# EAGLE schematic keyesSensBrd (EAGLE 6.5.0)
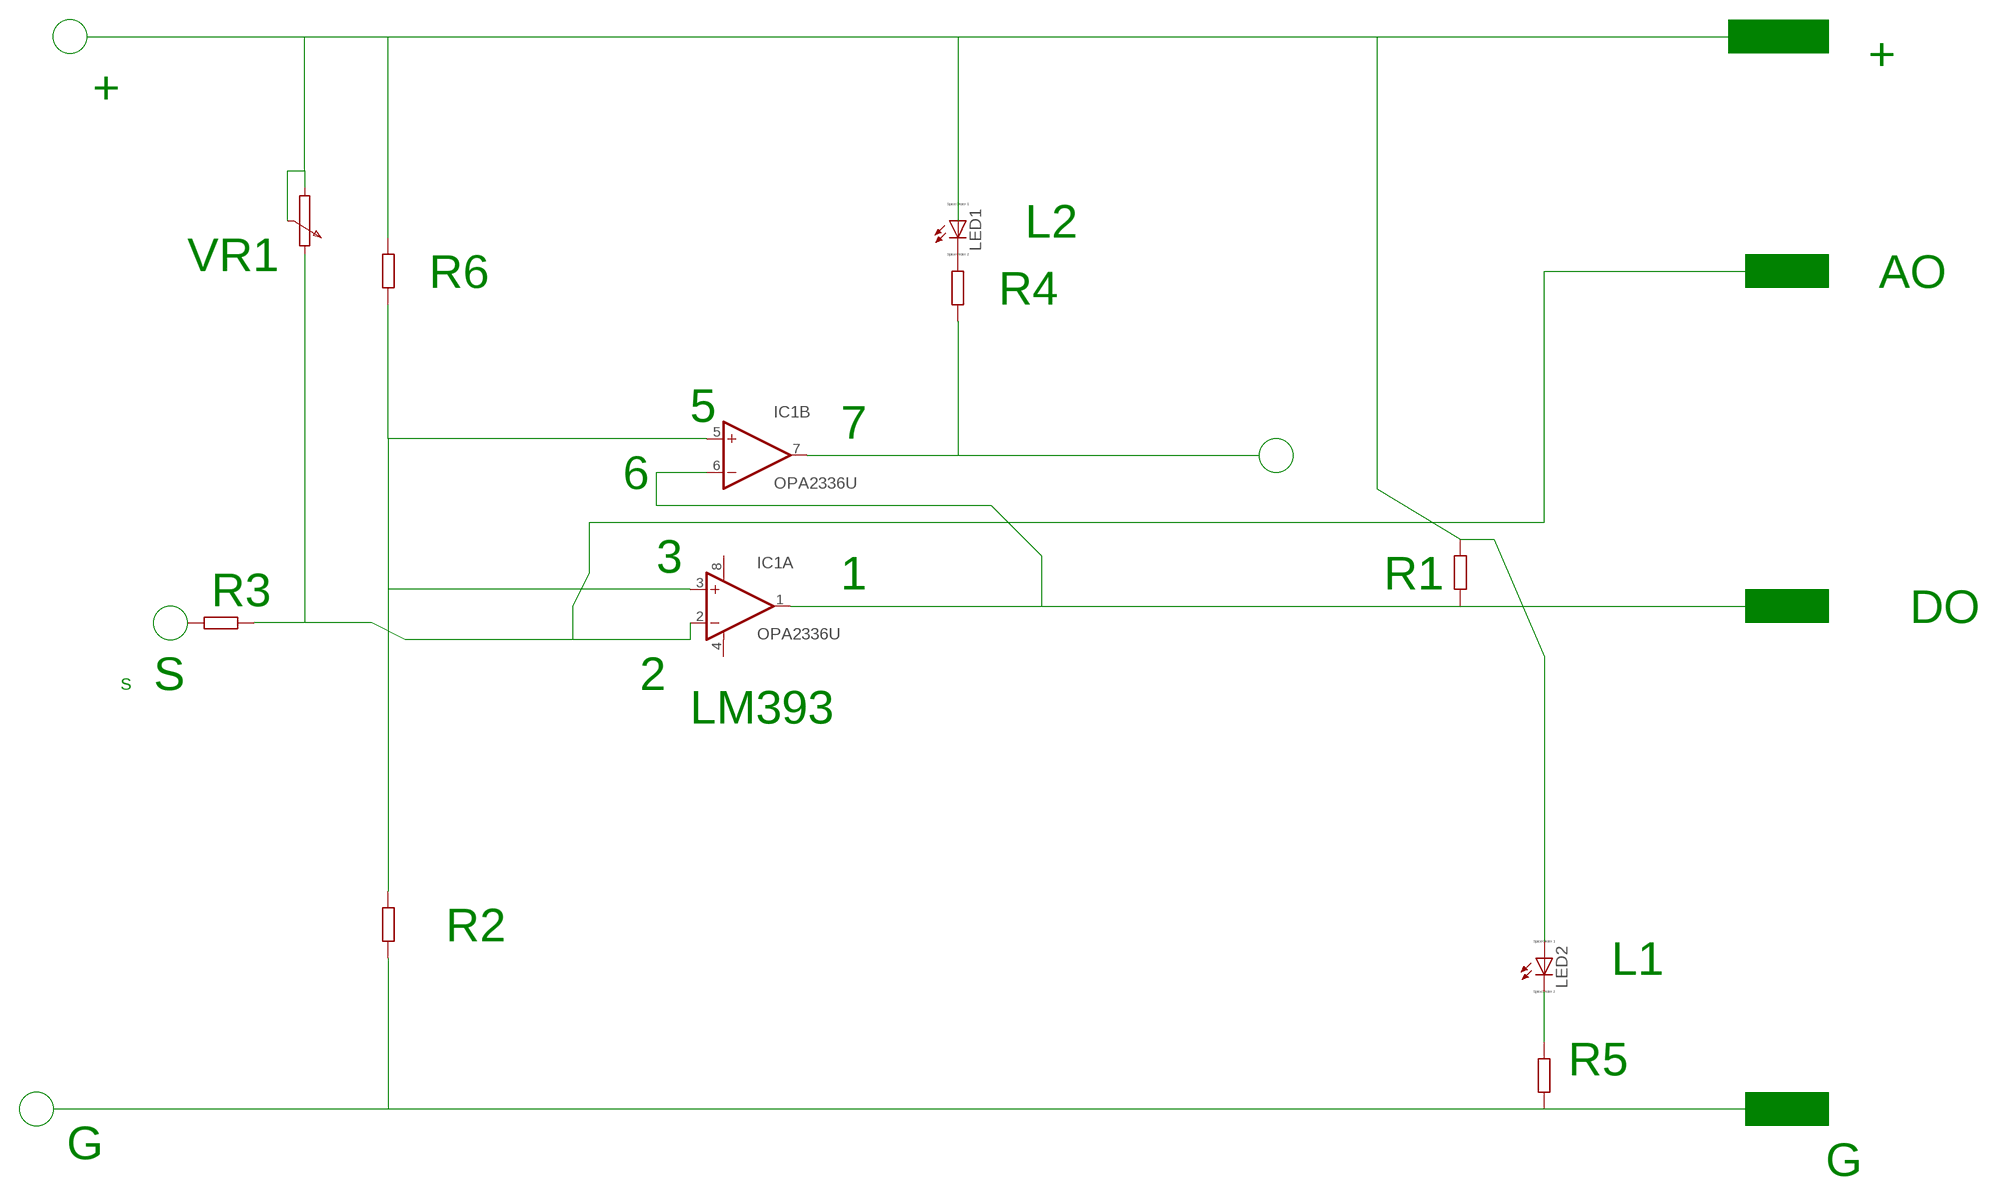
[diagram p0: schematic, sheet 1]

## Parts
IC1  OPA2336U  [SO08]
LED1  LED_E  [LED_1206]
LED2  LED_E  [LED_1206]

## Nets
N$3: IC1.7(B:OUT)
N$4: IC1.1(A:OUT)
N$6: IC1.5(B:+IN)
N$7: LED2.A
N$8: IC1.6(B:-IN)
N$9: LED2.C
N$10: IC1.3(A:+IN)
N$11: IC1.2(A:-IN)
Unconnected: LED1.A LED1.C

## Notes on the sheet
- +
- +
- L2
- R6 | AO
- VR1 | R4
- 5
- 7
- 6
- R1
- R3 | 3
- 1 | DO
- S | S | 2
- LM393
- R2
- L1
- R5
- G
- G

## Power pins joined to a net without a drawn wire
V+: IC1.8(A:V+)
V-: IC1.4(A:V-)

## Library data of the parts
IC1 = burr-brown:OPA2336: Single-Supply, MicroPower CMOS Operational Amplifiers MicroAmplifier Series; Product Folder:OPA2336,; MPN: OPA2336UA; OC_FARNELL: 1106183; OC_NEWARK: 24M5438
LED1 LED2 = eagle-ltspice:LED_E: LED Source: http://www.osram.convergy.de Source: www.luxeon.com Source: www.kingbright.com; SPICEMODEL: NONE; SPICEPREFIX: D; SPICETYPE: diode